# EAGLE design Enclosure 100x68 PBC-AZ (EAGLE 9.6.1)
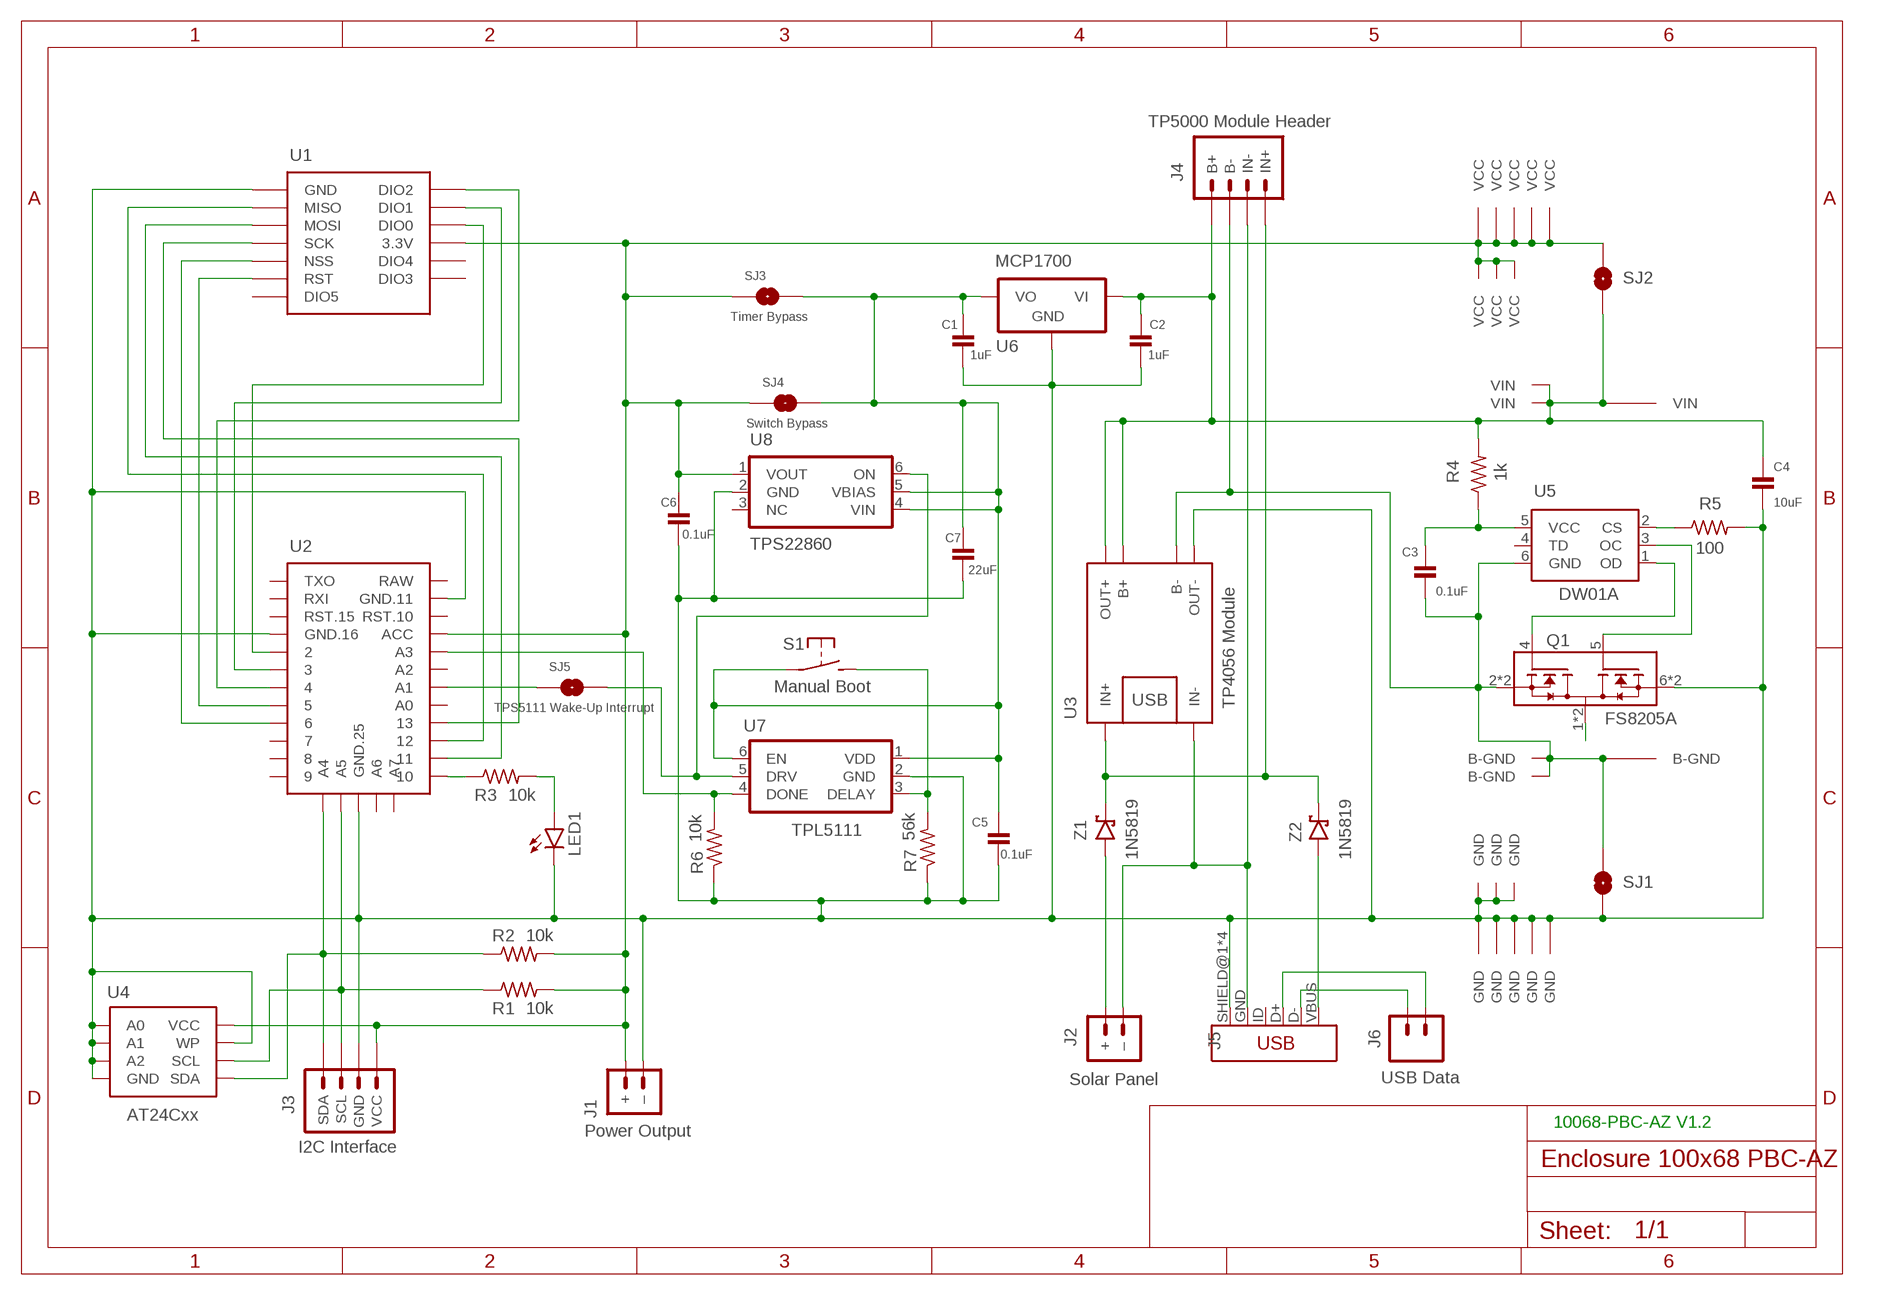
[diagram p0: schematic, sheet 1]
FRAME1 (A4L-LOC): TITLE: 10068-PBC-AZ V1.0

## Parts
C1  1uF  CAPACITOR  [C0805]
C2  1uF  CAPACITOR  [C0805]
C3  0.1uF  CAPACITOR  [C0805]
C4  10uF  CAPACITOR  [C0805]
C5  0.1uF  CAPACITOR  [C0805]
C6  0.1uF  CAPACITOR  [C0805]
C7  22uF  CAPACITOR  [C0805]
J1  Power Output  JST-PH1.25-MALE  [JST-PH1.25]
J2  Solar Panel  JST-PH2.0-MALE  [JST-PH2.0]
J3  I2C Interface  I2C-PIN-HEADER  [CONN_04-GENERIC]
J4  TP5000 Module Header  TP5000-MODULE  [CONN_04-GENERIC]
J5  USB  USB_MINI-B_SMT  [USB-MINIB]
J6  USB Data  1X2-PIN-HEADER  [CONN_02-GENERIC]
LED1  LEDCHIP-LED0805  [CHIP-LED0805]
Q1  FS8205A  [SOP65P640X120-8N]
R1  10k  RESISTORR0805  [R0805]
R2  10k  RESISTORR0805  [R0805]
R3  10k  RESISTORR0805  [R0805]
R4  1k  RESISTORR0805  [R0805]
R5  100  RESISTORR0805  [R0805]
R6  10k  RESISTORR0805  [R0805]
R7  56k  RESISTORR0805  [R0805]
S1  Manual Boot  2-PIN-MOMENTARY-SWITCH  [2-PAD-SWITCH]
SJ3  Timer Bypass  SJ  [SJ]
SJ4  Switch Bypass  SJ  [SJ]
SJ5  TPS5111 Wake-Up Interrupt  SJ  [SJ]
U1  RFM95W  RFM95W-PI  [RFM95W-PI]
U2  Arduino Pro Mini  ARDUINO-PRO-MINI  [PRO-MINI-29]
U3  TP4056 Module  BATTERY-CHARGER-LI-PROT  [BATTERY-CHARGER-LI-PROT]
U4  AT24Cxx  AT24CXX-EEPROM  [SOP-8]
U5  DW01A  [SOT23-6]
U6  MCP1700  [SOT23]
U7  TPL5111  TPL5111DDCR  [SOT-23-6]
U8  TPS22860  [SOT-23-6]
U$5  PROTO-34X22-BAT-SJ-CHG-Z  [PROTO-34X22-BAT-SJ-CHG-Z]
Z1  1N5819  1N5819-SOD-123  [SOD-123]
Z2  1N5819  1N5819-SOD-123  [SOD-123]

## Nets
GND: C1.2 C2.2 C4.2 C5.2 C6.2 C7.2 J1.-(–) J3.2(GND) J5.SHIELD@1(SHIELD) J5.SHIELD@2(SHIELD) J5.SHIELD@3(SHIELD) J5.SHIELD@4(SHIELD) LED1.C Q1.6(S2) Q1.7(S2) R5.2 R6.1 R7.1 U1.GND@3(GND) U1.GND@6(GND) U2.GND@11(GND.25) U2.GND@16(GND.16) U2.GND@25(GND.11) U3.OUT- U4.P$1(A0) U4.P$2(A1) U4.P$3(A2) U4.P$4(GND) U4.P$7(WP) U6.1(GND) U7.2(GND) U8.2(GND) U$5.GND U$5.P33-13(GND) U$5.P33-14(GND) U$5.P33-15(GND) U$5.P34-13(GND) U$5.P34-14(GND) U$5.P34-15(GND) U$5.P34-16(GND) U$5.P34-17(GND)
N$1: J2.+ Z1.A
N$2: J2.-(–) J4.2(IN-) J5.GND U3.IN-
N$3: R5.1 U5.2(CS)
N$4: Q1.1(D12) Q1.8(D12)
N$5: J4.1(IN+) U3.IN+ Z1.C Z2.C
N$6: C2.1 C4.1 J4.4(B+) R4.2 U3.B+ U3.OUT+ U6.3(VI) U$5.P02-17(VIN) U$5.P03-16(VIN) U$5.P06-19(VIN) U$5.VIN
N$7: J3.4(SDA) R2.1 U2.A4 U4.P$5(SDA)
N$8: J3.3(SCL) R1.1 U2.A5 U4.P$6(SCL)
N$9: U1.MISO U2.12
N$10: U1.MOSI U2.11
N$11: U1.SCK U2.13
N$12: R3.1 U2.10
N$13: U1.RST U2.5
N$14: U1.DIO2 U2.4
N$15: U1.DIO1 U2.3
N$16: U1.DIO0 U2.2
N$17: LED1.A R3.2
N$18: Q1.5(G2) U5.3(OC)
N$19: J5.VBUS Z2.A
N$20: Q1.4(G1) U5.1(OD)
N$21: J5.D+ J6.2
N$22: C3.1 R4.1 U5.5(VCC)
N$23: C3.2 J4.3(B-) Q1.2(S1) Q1.3(S1) U3.B- U5.6(GND) U$5.B-GND U$5.P28-19(B-GND) U$5.P32-16(B-GND) U$5.P33-17(B-GND)
N$24: J5.D- J6.1
N$25: R7.2 S1.P$2(S) U7.3(DELAY)
N$26: C1.1 C5.1 C7.1 S1.P$1(P) SJ3.2 SJ4.2 U6.2(VO) U7.1(VDD) U7.6(EN) U8.4(VIN) U8.5(VBIAS)
N$28: SJ5.2 U7.5(DRV) U8.6(ON)
N$29: R6.2 U2.A3 U7.4(DONE)
N$30: SJ5.1 U2.A1
NSS: U1.NSS U2.6
VCC: C6.1 J1.+ J3.1(VCC) R1.2 R2.2 SJ3.1 SJ4.1 U1.3V3(3.3V) U2.ACC U4.P$8(VCC) U8.1(VOUT) U$5.P01-13(VCC) U$5.P01-14(VCC) U$5.P01-15(VCC) U$5.P01-16(VCC) U$5.P01-17(VCC) U$5.P02-13(VCC) U$5.P02-14(VCC) U$5.P02-15(VCC) U$5.VCC
Unconnected: J5.ID U1.DIO3 U1.DIO4 U1.DIO5 U2.7 U2.8 U2.9 U2.A0 U2.A2 U2.A6 U2.A7 U2.RST@10(RST.10) U2.RST@15(RST.15) U2.RXI U2.TXO U5.4(TD) U8.3(NC)

## Notes on the sheet
- SJ2
- SJ1
- 10068-PBC-AZ V1.2

## Power pins joined to a net without a drawn wire
RAW: U2.RAW

## Library data of the parts
C1-C7 = digitalconcepts:CAPACITOR: 0805 Capacitor
J1 = digitalconcepts:JST-PH1.25-MALE: PH1.25 Male PCB Connector
J2 = digitalconcepts:JST-PH2.0-MALE: PH2.0 Male PCB Connector
J3 = digitalconcepts:I2C-PIN-HEADER: I2C Interface Pin Header
J4 = digitalconcepts:TP5000-MODULE: TP5000 Module Pin Header
J5 = digitalconcepts:USB_MINI-B: USB Mini-B Connector Breaks out 5 pins, and includes shield pins if needed.
J6 = digitalconcepts:1X2-PIN-HEADER: Single Row 2-Pin Header
LED1 = digitalconcepts:LED: LED OSRAM: - CHIPLED LG R971, LG N971, LY N971, LG Q971, LY Q971, LO R971, LY R971 LH N974, LH R974 LS Q976, LO Q976, LY Q976 LO Q996 - Hyper CHIPLED LW Q18S LB Q993, LB Q99A, LB R99A - SideLED LS A670, LO A670, LY A670, LG A670, LP A670 LB A673, LV A673, LT A673, LW A673 LH A674 LY A675 LS A676, LA A676, LO A676, LY A676, LW A676 LS A679, LY A679, LG A679 - Hyper Micro SIDELED® LS Y876, LA Y876, LO Y876, LY Y876 LT Y87S - SmartLED LW L88C, LW L88S LB L89C, LB L89S, LG L890 LS L89K, LO L89K, LY L89K LS L896, LA L896, LO L896, LY L896 - TOPLED LS T670, LO T670, LY T670, LG T670, LP T670 LSG T670, LSP T670, LSY T670, LOP T670, LYG T670 LG T671, LOG T671, LSG T671 LB T673, LV T673, LT T673, LW T673 LH T674 LS T676, LA T676, LO T676, LY T676, LB T676, LH T676, LSB T676, LW T676 LB T67C, LV T67C, LT T67C, LS T67K, LO T67K, LY T67K, LW E67C LS E67B, LA E67B, LO E67B, LY E67B, LB E67C, LV E67C, LT E67C LW T67C LS T679, LY T679, LG T679 LS T770, LO T770, LY T770, LG T770, LP T770 LB T773, LV T773, LT T773, LW T773 LH T774 LS E675, LA E675, LY E675, LS T675 LS T776, LA T776, LO T776, LY T776, LB T776 LHGB T686 LT T68C, LB T68C - Hyper Mini TOPLED® LB M676 - Mini TOPLED Santana® LG M470 LS M47K, LO M47K, LY M47K Source: http://www.osram.convergy.de LUXEON: - LUMILED® LXK2-PW12-R00, LXK2-PW12-S00, LXK2-PW14-U00, LXK2-PW14-V00 LXK2-PM12-R00, LXK2-PM12-S00, LXK2-PM14-U00 LXK2-PE12-Q00, LXK2-PE12-R00, LXK2-PE12-S00, LXK2-PE14-T00, LXK2-PE14-U00 LXK2-PB12-K00, LXK2-PB12-L00, LXK2-PB12-M00, LXK2-PB14-N00, LXK2-PB14-P00, LXK2-PB14-Q00 LXK2-PR12-L00, LXK2-PR12-M00, LXK2-PR14-Q00, LXK2-PR14-R00 LXK2-PD12-Q00, LXK2-PD12-R00, LXK2-PD12-S00 LXK2-PH12-R00, LXK2-PH12-S00 LXK2-PL12-P00, LXK2-PL12-Q00, LXK2-PL12-R00 Source: www.luxeon.com KINGBRIGHT: KA-3528ASYC Source: www.kingbright.com
Q1 = FS8205A:FS8205A: N/A; AVAILABILITY: Unavailable; MF: Fortune Semiconductor; MP: FS8205A; PACKAGE: Package; PRICE: None
R1-R7 = digitalconcepts:RESISTOR: RESISTOR, American symbol; SPICEPREFIX: R
S1 = digitalconcepts:2-PIN-MOMENTARY-SWITCH: 2 Pin Momentary Switch
SJ3-SJ5 = digitalconcepts:SJ: Solder Jumper
U1 = digitalconcepts:RFM95W-PI: RFM95W LoRa Wireless Transceiver Raspberry Pi Daughter Board
U2 = digitalconcepts:ARDUINO-PRO-MINI: Arduino Pro Mini 29 [+6] Pin 'Clone'
U3 = digitalconcepts:BATTERY-CHARGER-LI-PROT: TP4056 Li Battery Charger module with PCB (rather than module) footprint
U4 = digitalconcepts:AT24CXX-EEPROM: AT24Cxx EEPROM SOP-8
U5 = DW01A:DW01A; AVAILABILITY: Unavailable; DESCRIPTION: One Cell Lithium-ion/Polymer Battery Protection IC; MF: Fortune Semiconductor; MP: DW01A; PACKAGE: SOT-23-6 Fortune Semiconductor; PRICE: None
U6 = digitalconcepts:MCP1700: MCP1700 Low Quiescent Current LDO Voltage Regulator
U7 = TPL5111DDCR:TPL5111DDCR: TPL5111 Nano-Power System Timer
U8 = TPL5111DDCR:TPS22860: Texas Instruments TPS22860 Ultra-Low Leakage Load Switch
U$5 = digitalconcepts:PROTO-34X22-BAT-SJ-CHG-Z: 34 x 22 Prototyping board, with battery connection (GND + Vcc plane) and space for charging module, voltage regulator, solar panel connection, Arduino Pro Mini and RFM95W daughter board, to fit a 100 x 68 enclosure
Z1 Z2 = digitalconcepts:1N5819-SOD-123: 1N5819 Schottky Diode SOD-123

## Board
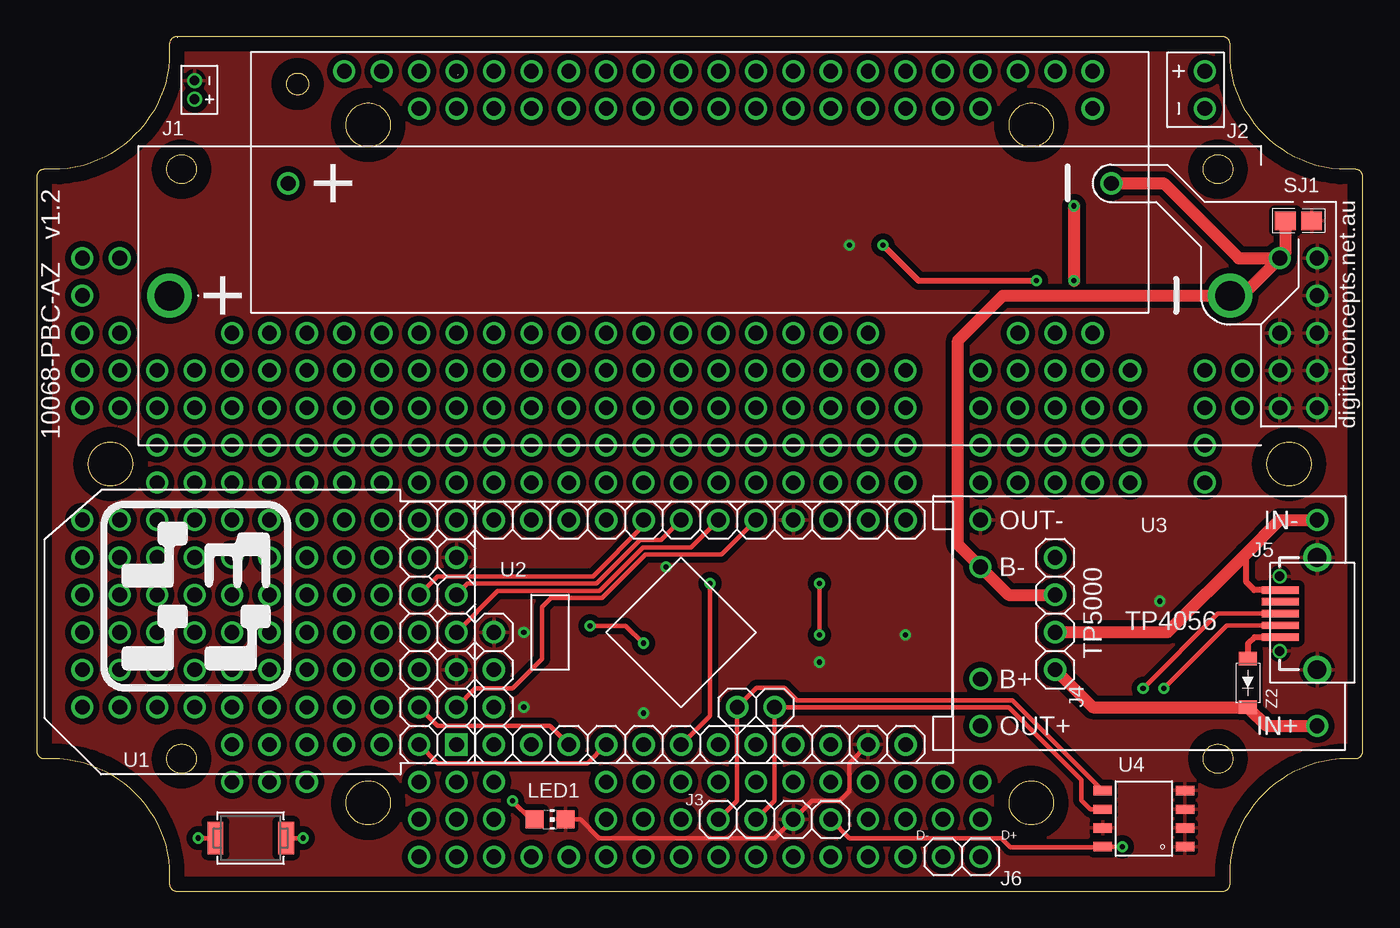
[diagram p1: board, top side]
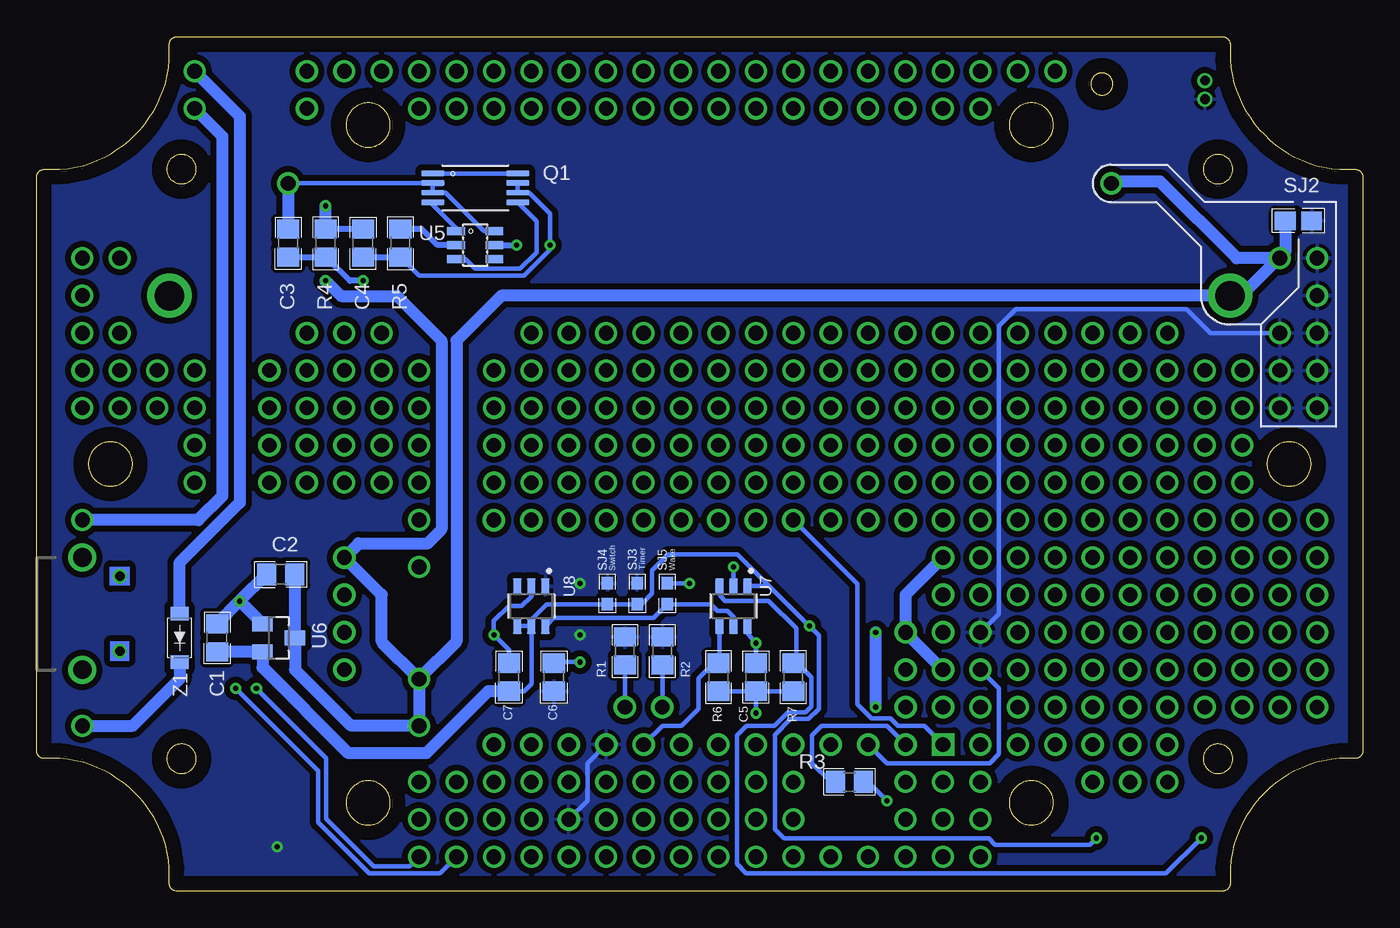
[diagram p2: board, bottom side, seen from below]

Size 90 x 58 mm. Coordinates in mm from the lower left corner, seen from the top.
Outline: 1271 segments
Copper layers (1*16): Top 0.035mm / dielectric 1.5mm / Bottom 0.035mm
Design rules "default *": minimum track width 6mil, minimum drill 0.35mm, track to track 6mil, track to pad 6mil, pad to pad 6mil, via to via 6mil, smd to smd 6mil, copper to edge 40mil, drill to drill 6mil, minimum pad ring 1mil, minimum via ring 8mil, stop-mask expansion 4mil, vias tented up to drill 0mil, thermal gap 10mil

### Footprints (pad centres in the part's own frame; a part is rotated, then mirrored left to right if it is on the bottom)
C0805 = smd 1.3 x 1.5: 1 -0.95,0; 2 0.95,0
JST-PH1.25 = drill 0.65 pad 1.016: + -0.635,0; - 0.635,0
JST-PH2.0 = drill 1: + -1.27,0; - 1.27,0
CONN_04-GENERIC = drill 1 pad 1.524: 1 0,0; 2 2.54,0; 3 5.08,0; 4 7.62,0
USB-MINIB = smd 2.5 x 0.5: D+ 2.5,0; D- 2.5,0.8; GND 2.5,-1.6; ID 2.5,-0.8; VBUS 2.5,1.6 | drill 1.27: SHIELD@1 0,3.81; SHIELD@2 0,-3.81 | drill 0.65 pad 0.762: SHIELD@3 2.54,2.54; SHIELD@4 2.54,-2.54
CONN_02-GENERIC = drill 1 pad 1.524: 1 0,0; 2 2.54,0
CHIP-LED0805 = smd 1.2 x 1.2: A 0,-1.05; C 0,1.05
SOP65P640X120-8N = smd 1.56 x 0.4: 1 -2.88,0.975; 2 -2.88,0.325; 3 -2.88,-0.325; 4 -2.88,-0.975; 5 2.88,-0.975; 6 2.88,-0.325; 7 2.88,0.325; 8 2.88,0.975
R0805 = smd 1.3 x 1.5: 1 -0.95,0; 2 0.95,0
2-PAD-SWITCH = smd 1.067 x 2.184: P$1 -2.4,0; P$2 2.4,0
SJ = smd 0.864 x 0.762: 1 -0.711,0; 2 0.711,0
RFM95W-PI = drill 1 pad 1.524: 3V3 7.62,2.54; DIO0 2.54,0; DIO1 7.62,0; DIO2 10.16,0; DIO3 12.7,2.54; DIO4 15.24,2.54; DIO5 15.24,0; GND@3 5.08,0; GND@6 12.7,0; MISO 2.54,2.54; MOSI 5.08,2.54; RST 10.16,2.54; SCK 0,2.54 | drill 1 pad 1.524 square: NSS 0,0
PRO-MINI-29 = drill 1 pad 1.524: 2 17.78,7.62; 3 15.24,7.62; 4 12.7,7.62; 5 10.16,7.62; 6 7.62,7.62; 7 5.08,7.62; 8 2.54,7.62; 9 0,7.62; 10 0,-7.62; 11 2.54,-7.62; 12 5.08,-7.62; 13 7.62,-7.62; A0 10.16,-7.62; A1 12.7,-7.62; A2 15.24,-7.62; A3 17.78,-7.62; A4 16.51,-5.08; A5 19.05,-5.08; A6 0,-2.54; A7 0,-5.08; ACC 20.32,-7.62; GND@11 25.4,-7.62; GND@16 20.32,7.62; GND@25 0,0; RAW 27.94,-7.62; RST@10 22.86,-7.62; RST@15 22.86,7.62; RXI 25.4,7.62; TXO 27.94,7.62
BATTERY-CHARGER-LI-PROT = drill 1: B+ 10.795,3.81; B- 10.795,-3.81; IN+ -12.065,6.985; IN- -12.065,-6.985; OUT+ 10.795,6.985; OUT- 10.795,-6.985
SOP-8 = smd 0.635 x 1.27: P$1 -1.905,-2.794; P$2 -0.635,-2.794; P$3 0.635,-2.794; P$4 1.905,-2.794; P$5 1.905,2.794; P$6 0.635,2.794; P$7 -0.635,2.794; P$8 -1.905,2.794
SOT23-6 = smd 0.55 x 1.2: 1 -0.95,-1.3; 2 0,-1.3; 3 0.95,-1.3; 4 0.95,1.3; 5 0,1.3; 6 -0.95,1.3
SOT23 = smd 1 x 1.4: 1 -0.95,-1.1; 2 0.95,-1.1; 3 0,1.1
SOT-23-6 = smd 1.1 x 0.6: 1 -1.35,0.95; 2 -1.35,0; 3 -1.35,-0.95; 4 1.35,-0.95; 5 1.35,0; 6 1.35,0.95
PROTO-34X22-BAT-SJ-CHG-Z = smd 1.422 x 1.27: B-GND 39.751,16.51; GND 41.529,16.51 | drill 1: P01-05 -41.91,-16.51; P01-06 -41.91,-13.97; P01-07 -41.91,-11.43; P01-08 -41.91,-8.89; P01-09 -41.91,-6.35; P01-10 -41.91,-3.81; P01-13 -41.91,3.81; P01-14 -41.91,6.35; P01-15 -41.91,8.89; P01-16 -41.91,11.43; P01-17 -41.91,13.97; P02-05 -39.37,-16.51; P02-06 -39.37,-13.97; P02-07 -39.37,-11.43; P02-08 -39.37,-8.89; P02-09 -39.37,-6.35; P02-10 -39.37,-3.81; P02-13 -39.37,3.81; P02-14 -39.37,6.35; P02-15 -39.37,8.89; P02-17 -39.37,13.97; P03-05 -36.83,-16.51; P03-06 -36.83,-13.97; P03-07 -36.83,-11.43; P03-08 -36.83,-8.89; P03-09 -36.83,-6.35; P03-10 -36.83,-3.81; P03-11 -36.83,-1.27; P03-12 -36.83,1.27; P03-13 -36.83,3.81; P03-14 -36.83,6.35; P04-05 -34.29,-16.51; P04-06 -34.29,-13.97; P04-07 -34.29,-11.43; P04-08 -34.29,-8.89; P04-09 -34.29,-6.35; P04-10 -34.29,-3.81; P04-11 -34.29,-1.27; P04-12 -34.29,1.27; P04-13 -34.29,3.81; P04-14 -34.29,6.35; P05-03 -31.75,-21.59; P05-04 -31.75,-19.05; P05-05 -31.75,-16.51; P05-06 -31.75,-13.97; P05-07 -31.75,-11.43; P05-08 -31.75,-8.89; P05-09 -31.75,-6.35; P05-10 -31.75,-3.81; P05-11 -31.75,-1.27; P05-12 -31.75,1.27; P05-13 -31.75,3.81; P05-14 -31.75,6.35; P05-15 -31.75,8.89; P06-03 -29.21,-21.59; P06-04 -29.21,-19.05; P06-05 -29.21,-16.51; P06-06 -29.21,-13.97; P06-07 -29.21,-11.43; P06-08 -29.21,-8.89; P06-09 -29.21,-6.35; P06-10 -29.21,-3.81; P06-11 -29.21,-1.27; P06-12 -29.21,1.27; P06-13 -29.21,3.81; P06-14 -29.21,6.35; P06-15 -29.21,8.89; P06-19 -27.94,19.05; P07-03 -26.67,-21.59; P07-04 -26.67,-19.05; P07-05 -26.67,-16.51; P07-06 -26.67,-13.97; P07-07 -26.67,-11.43; P07-08 -26.67,-8.89; P07-09 -26.67,-6.35; P07-10 -26.67,-3.81; P07-11 -26.67,-1.27; P07-12 -26.67,1.27; P07-13 -26.67,3.81; P07-14 -26.67,6.35; P07-15 -26.67,8.89; P08-04 -24.13,-19.05; P08-05 -24.13,-16.51; P08-06 -24.13,-13.97; P08-07 -24.13,-11.43; P08-08 -24.13,-8.89; P08-09 -24.13,-6.35; P08-10 -24.13,-3.81; P08-11 -24.13,-1.27; P08-12 -24.13,1.27; P08-13 -24.13,3.81; P08-14 -24.13,6.35; P08-15 -24.13,8.89; P08-22 -24.13,26.67; P09-04 -21.59,-19.05; P09-05 -21.59,-16.51; P09-06 -21.59,-13.97; P09-07 -21.59,-11.43; P09-08 -21.59,-8.89; P09-09 -21.59,-6.35; P09-10 -21.59,-3.81; P09-11 -21.59,-1.27; P09-12 -21.59,1.27; P09-13 -21.59,3.81; P09-14 -21.59,6.35; P09-15 -21.59,8.89; P09-22 -21.59,26.67; P10-01 -19.05,-26.67; P10-02 -19.05,-24.13; P10-03 -19.05,-21.59; P10-11 -19.05,-1.27; P10-12 -19.05,1.27; P10-13 -19.05,3.81; P10-14 -19.05,6.35; P10-15 -19.05,8.89; P10-21 -19.05,24.13; P10-22 -19.05,26.67; P11-01 -16.51,-26.67; P11-02 -16.51,-24.13; P11-03 -16.51,-21.59; P11-11 -16.51,-1.27; P11-12 -16.51,1.27; P11-13 -16.51,3.81; P11-14 -16.51,6.35; P11-15 -16.51,8.89; P11-21 -16.51,24.13; P11-22 -16.51,26.67; P12-01 -13.97,-26.67; P12-02 -13.97,-24.13; P12-03 -13.97,-21.59; P12-11 -13.97,-1.27; P12-12 -13.97,1.27; P12-13 -13.97,3.81; P12-14 -13.97,6.35; P12-15 -13.97,8.89; P12-21 -13.97,24.13; P12-22 -13.97,26.67; P13-01 -11.43,-26.67; P13-11 -11.43,-1.27; P13-12 -11.43,1.27; P13-13 -11.43,3.81; P13-14 -11.43,6.35; P13-15 -11.43,8.89; P13-21 -11.43,24.13; P13-22 -11.43,26.67; P14-01 -8.89,-26.67; P14-11 -8.89,-1.27; P14-12 -8.89,1.27; P14-13 -8.89,3.81; P14-14 -8.89,6.35; P14-15 -8.89,8.89; P14-21 -8.89,24.13; P14-22 -8.89,26.67; P15-01 -6.35,-26.67; P15-02 -6.35,-24.13; P15-03 -6.35,-21.59; P15-11 -6.35,-1.27; P15-12 -6.35,1.27; P15-13 -6.35,3.81; P15-14 -6.35,6.35; P15-15 -6.35,8.89; P15-21 -6.35,24.13; P15-22 -6.35,26.67; P16-01 -3.81,-26.67; P16-02 -3.81,-24.13; P16-03 -3.81,-21.59; P16-11 -3.81,-1.27; P16-12 -3.81,1.27; P16-13 -3.81,3.81; P16-14 -3.81,6.35; P16-15 -3.81,8.89; P16-21 -3.81,24.13; P16-22 -3.81,26.67; P17-01 -1.27,-26.67; P17-02 -1.27,-24.13; P17-03 -1.27,-21.59; P17-11 -1.27,-1.27; P17-12 -1.27,1.27; P17-13 -1.27,3.81; P17-14 -1.27,6.35; P17-15 -1.27,8.89; P17-21 -1.27,24.13; P17-22 -1.27,26.67; P18-01 1.27,-26.67; P18-03 1.27,-21.59; P18-11 1.27,-1.27; P18-12 1.27,1.27; P18-13 1.27,3.81; P18-14 1.27,6.35; P18-15 1.27,8.89; P18-21 1.27,24.13; P18-22 1.27,26.67; P19-01 3.81,-26.67; P19-03 3.81,-21.59; P19-11 3.81,-1.27; P19-12 3.81,1.27; P19-13 3.81,3.81; P19-14 3.81,6.35; P19-15 3.81,8.89; P19-21 3.81,24.13; P19-22 3.81,26.67; P20-01 6.35,-26.67; P20-03 6.35,-21.59; P20-11 6.35,-1.27; P20-12 6.35,1.27; P20-13 6.35,3.81; P20-14 6.35,6.35; P20-15 6.35,8.89; P20-21 6.35,24.13; P20-22 6.35,26.67; P21-01 8.89,-26.67; P21-03 8.89,-21.59; P21-11 8.89,-1.27; P21-12 8.89,1.27; P21-13 8.89,3.81; P21-14 8.89,6.35; P21-15 8.89,8.89; P21-21 8.89,24.13; P21-22 8.89,26.67; P22-01 11.43,-26.67; P22-02 11.43,-24.13; P22-03 11.43,-21.59; P22-11 11.43,-1.27; P22-12 11.43,1.27; P22-13 11.43,3.81; P22-14 11.43,6.35; P22-15 11.43,8.89; P22-21 11.43,24.13; P22-22 11.43,26.67; P23-01 13.97,-26.67; P23-02 13.97,-24.13; P23-03 13.97,-21.59; P23-11 13.97,-1.27; P23-12 13.97,1.27; P23-13 13.97,3.81; P23-14 13.97,6.35; P23-21 13.97,24.13; P23-22 13.97,26.67; P24-02 16.51,-24.13; P24-03 16.51,-21.59; P24-21 16.51,24.13; P24-22 16.51,26.67; P25-02 19.05,-24.13; P25-03 19.05,-21.59; P25-11 19.05,-1.27; P25-12 19.05,1.27; P25-13 19.05,3.81; P25-14 19.05,6.35; P25-21 19.05,24.13; P25-22 19.05,26.67; P26-11 21.59,-1.27; P26-12 21.59,1.27; P26-13 21.59,3.81; P26-14 21.59,6.35; P26-15 21.59,8.89; P26-22 21.59,26.67; P27-11 24.13,-1.27; P27-12 24.13,1.27; P27-13 24.13,3.81; P27-14 24.13,6.35; P27-15 24.13,8.89; P27-22 24.13,26.67; P28-11 26.67,-1.27; P28-12 26.67,1.27; P28-13 26.67,3.81; P28-14 26.67,6.35; P28-15 26.67,8.89; P28-19 27.94,19.05; P28-21 26.67,24.13; P28-22 26.67,26.67; P29-11 29.21,-1.27; P29-12 29.21,1.27; P29-13 29.21,3.81; P29-14 29.21,6.35; P31-11 34.29,-1.27; P31-12 34.29,1.27; P31-13 34.29,3.81; P31-14 34.29,6.35; P32-13 36.83,3.81; P32-14 36.83,6.35; P33-13 39.37,3.81; P33-14 39.37,6.35; P33-15 39.37,8.89; P33-17 39.37,13.97; P34-13 41.91,3.81; P34-14 41.91,6.35; P34-15 41.91,8.89; P34-16 41.91,11.43; P34-17 41.91,13.97 | drill 2: P03-16 -36.005,11.43; P32-16 36.005,11.43 | smd 1.422 x 1.27 bottom: VCC -41.529,16.51; VIN -39.751,16.51
SOD-123 = smd 0.91 x 1.22: A -1.65,0; C 1.65,0

### Placement (x,y rotation side)
C1  77.77,17.19 90 bottom
C2  73.45,21.51 180 bottom
C3  72.94,43.99 90 bottom
C4  67.86,43.99 270 bottom
C5  41.19,14.52 270 bottom
C6  54.91,14.52 90 bottom
C7  57.95,14.52 90 bottom
J1  10.71,54.4 90 top
J2  79.29,54.4 270 top
J3  53.89,4.87 180 top
J4  69.13,15.03 90 top
J5  86.91,18.84 180 top
J6  61.51,2.33 0 top
LED1  34.84,4.87 270 top
Q1  60.24,47.74 0 bottom
R1  50.08,16.3 90 bottom
R2  47.54,16.3 90 bottom
R3  34.84,7.41 0 bottom
R4  70.4,43.99 90 bottom
R5  65.32,43.99 270 bottom
R6  43.73,14.52 90 bottom
R7  38.65,14.52 90 bottom
S1  14.52,3.6 180 top
SJ3  49.24,20.19 270 bottom
SJ4  51.27,20.19 270 bottom
SJ5  47.21,20.19 270 bottom
U1  28.49,9.95 90 top
U2  31.03,17.57 0 top
U3  74.84,18.2 180 top
U4  75.15,4.92 90 top
U5  60.24,43.86 270 bottom
U6  73.57,17.19 270 bottom
U7  42.71,19.35 270 bottom
U8  56.43,19.35 270 bottom
U$5  45,29 0 top
Z1  80.31,17.19 270 bottom
Z2  82.21,14.14 270 top

### Tracks (layer width: path | path; a pad name or v marks a point on that pad's centre or on a via)
GND  (via drill 0.35)
  Top 0.305: U2.GND@11 55.16,8.68 55.16,6.77 54.52,6.14 52.62,6.14 J3.2 50.08,3.6 38.18,3.6 36.91,4.87 LED1.C
  Bottom 0.305: R5.2 64.06,41.78 56.93,41.78 55.16,43.55 v55.16,43.86 55.16,45.98 56.59,47.41 Q1.6 Q1.7 | R7.1 C5.2 | C5.2 R6.1 | v42.71,22.01 U7.2 | 56.44,20.66 U8.2 | U8.2 56.43,20.06 | C7.2 57.95,16.38 v58.97,17.39 59,17.35 59,18.35 57.96,19.35 57.09,19.35 56.43,20.01 U8.2 | C6.2 54.83,15.55 v53.13,15.55 | C5.2 v41.19,12.08
  Bottom 0.406: C4.2 R5.2
  Bottom 0.813: C2.2 v76.22,19.68 | v76.22,19.68 U6.1 | C1.2 v76.22,19.68 | U1.GND@3 U2.GND@25 31.03,20.11 U1.GND@6 | v33.06,17.57 v33.06,12.49
  pour Top (isolate 0.406): -1.48,59.48 -1.48,-1.48 91.61,-1.48 91.61,59.48
N$1
  Bottom 0.813: J2.+ 76.23,52.61 76.23,26.37 80.33,22.27 80.33,18.86 Z1.A
N$2
  Top 0.152: 82.64,20.44 82.63,20.45
  Top 0.406: 82.63,20.45 82.08,21 82.08,22.9 | J5.GND 82.64,20.44
  Top 0.813: U3.IN- 84.37,25.19 82.08,22.9 76.75,17.57 J4.2
  Bottom 0.813: U3.IN- 79.04,25.19 77.38,26.84 77.38,51.22 J2.-
N$3
  Bottom 0.406: R5.1 63.86,44.94 62.78,43.86 U5.2
N$4
  Bottom 0.305: Q1.8 Q1.1
N$5
  Top 0.813: U3.IN+ 83.48,11.22 Z2.C 81.75,12.49 81.75,12.48 71.68,12.48 J4.1
  Bottom 0.813: U3.IN+ 83.48,11.22 80.31,14.4 Z1.C
N$6  (via drill 0.35)
  Top 0.813: v70.4,46.53 v70.4,41.45
  Bottom 0.152: 72.5,17.21 U6.3
  Bottom 0.406: C4.1 R4.2
  Bottom 0.813: C2.1 72.5,17.21 | U6.3 72.47,15.03 68.66,11.22 U3.OUT+ U3.B+ | U3.B+ 66.59,16.93 66.59,20.11 J4.4 68.16,23.61 63.47,23.61 62.53,24.55 62.53,37.38 65.55,40.4 69.36,40.4 v70.4,41.45 | U$5.P06-19 16.93,48.18 13.76,48.18 8.55,42.97 U$5.P02-17 | U$5.P02-17 5.69,42.97 8.23,40.43 U$5.P03-16 58.46,40.43 61.51,37.38 61.51,16.93 U3.B+ | U$5.P02-17 5.26,43.34 5.26,45.5 U$5.VIN | R4.2 v70.4,46.53
N$7
  Top 0.305: J3.4 47.54,6.14 U2.A4 48.83,13.78 50.77,13.78 51.6,12.95 66.21,12.95 72.33,6.83 U4.P$5
  Bottom 0.305: R2.1 U2.A4
N$8
  Top 0.305: J3.3 50.08,6.14 U2.A5 65.98,12.49 70.91,7.56 70.91,6.16 71.52,5.56 U4.P$6
  Bottom 0.305: R1.1 U2.A5
N$9
  Top 0.305: U1.MISO 27.22,11.22 34.84,11.22 U2.12
N$10
  Bottom 0.305: U1.MOSI 24.68,13.76 24.68,9.31 25.31,8.68 32.3,8.68 U2.11
N$11
  Top 0.305: U1.SCK 27.22,8.68 37.38,8.68 U2.13
N$12
  Bottom 0.305: U2.10 32.3,11.22 36.74,11.22 37.38,10.58 37.38,8.68 36.11,7.41 R3.1
N$13
  Top 0.305: U1.RST 27.22,21.38 37.76,21.38 41.19,24.81 U2.5
N$14
  Top 0.305: U1.DIO2 29.25,20.87 37.99,20.87 40.96,23.84 42.38,23.84 U2.4
N$15
  Top 0.305: U1.DIO1 31.28,20.36 38.19,20.36 41.16,23.34 44.42,23.34 U2.3
N$16
  Top 0.305: U1.DIO0 29.76,13.76 32.3,13.76 34.31,15.77 34.31,19.3 34.92,19.91 38.38,19.91 41.33,22.85 46.47,22.85 U2.2
N$17  (via drill 0.35)
  Top 0.305: v32.3,6.14 32.3,6.11 33.54,4.87 LED1.A
  Bottom 0.305: v32.3,6.14 33.57,7.41 R3.2
N$18
  Bottom 0.305: Q1.5 56.09,45.5 56.09,43.36 57.2,42.25 60.24,42.25 60.9,42.91 U5.3
N$19
  Top 0.406: J5.VBUS 82.64,17.24 82.21,16.81 Z2.A
N$20
  Bottom 0.305: Q1.4 63.12,46.59 61.54,45.01 U5.1
N$21  (via drill 0.35)
  Top 0.305: J5.D+ 80.18,18.84 v75.1,13.76
  Bottom 0.305: v75.1,13.76 70.35,9.01 70.35,4.89 67.15,1.69 64.68,1.69 J6.2
N$22  (via drill 0.35)
  Top 0.406: v57.45,43.86 59.86,41.45 v67.86,41.45
  Bottom 0.406: C3.1 R4.1 70.38,43.02 70.32,43.02 68.75,41.45 v67.86,41.45 | U5.5 v57.45,43.86
N$23
  Top 0.813: U$5.P33-17 81.83,40.43 U$5.P32-16 65.57,40.43 62.53,37.38 62.53,23.54 U3.B- 65.95,20.11 J4.3 | U$5.P28-19 76.5,48.05 81.58,42.97 U$5.P33-17 | U$5.B-GND 84.75,43.35 U$5.P33-17
  Bottom 0.305: Q1.2 Q1.3 62.25,47.41 59.65,44.81 U5.6 | 62.49,48.05 U$5.P28-19
  Bottom 0.406: Q1.2 62.49,48.05
  Bottom 0.813: U$5.P28-19 C3.2
N$24  (via drill 0.35)
  Top 0.305: J5.D- 80.78,18.04 v76.5,13.76
  Bottom 0.305: v76.5,13.76 70.91,8.17 70.91,4.68 67.44,1.21 62.62,1.21 J6.1
N$25  (via drill 0.35)
  Top 0.305: v10.96,3.6 S1.P$2
  Bottom 0.152: R7.2 38.45,15.67
  Bottom 0.305: v10.96,3.6 13.35,1.21 41.85,1.21 42.48,1.85 42.48,10.56 41.82,11.22 39.93,11.22 39.02,12.13 37.81,12.13 37.4,12.54 37.4,14.51 38.37,15.47 R7.2 | U7.3 43.63,20.06 43.27,19.7 40.33,19.7 38.45,17.82 38.45,15.67
N$26  (via drill 0.35)
  Top 0.305: v37.56,18 39.94,18 v41.19,16.83 | v18.08,3.6 S1.P$1
  Bottom 0.203: SJ3.2 48.96,19.46
  Bottom 0.305: v18.08,3.6 v18.09,3.6 18.53,3.16 24.95,3.16 25.38,3.59 39.28,3.59 39.89,4.21 39.89,10.61 38.83,11.68 37.61,11.68 36.92,12.36 36.92,17.37 v37.56,18 37.58,18 40.29,20.71 | C5.1 v41.19,16.83 41.74,17.46 U7.6 | C7.1 56.91,13.57 56.43,14.05 U8.5 | SJ3.2 SJ4.2 55.4,19.46 56.43,18.43 U8.5 | 40.29,20.71 42.43,22.85 47.14,22.85 48.23,21.77 48.23,20.2 48.96,19.46 | U8.5 U8.4 | U7.1 40.29,20.71
  Bottom 0.813: C1.1 U6.2 74.67,15.18 68.86,9.37 63.57,9.37 59.36,13.57 C7.1
N$28
  Bottom 0.203: U7.5 42.68,18.2
  Bottom 0.305: U8.6 55.41,18.05 54.91,18.55 48.15,18.55 47.23,19.46 SJ5.2 44.24,19.46 43.8,19.02 43.11,19.02 42.68,18.59 42.68,18.2
N$29
  Bottom 0.305: U7.4 43.66,15.47 R6.2 44.05,15.47 45.08,14.45 45.08,12.39 46.24,11.22 47.54,11.22 U2.A3
N$30  (via drill 0.35)
  Top 0.305: v45.69,20.9 45.69,11.89 43.75,9.95 U2.A1
  Bottom 0.305: v45.69,20.9 SJ5.1
NSS
  Bottom 0.305: U1.NSS 29.76,11.22 31.54,11.22 32.05,11.73 33.34,11.73 34.31,12.69 34.31,20.85 U2.6
VCC  (via drill 0.35)
  Top 0.305: J3.1 55.16,3.6 65.47,3.6 66.08,2.99 72.33,2.99 U4.P$8 v73.68,3.02 | v53.13,20.9 v53.13,17.39
  Bottom 0.305: J3.1 52.62,6.14 52.62,8.68 U2.ACC | U1.3V3 24.69,18.83 24.69,38.35 23.53,39.52 11.95,39.52 10.33,37.89 U$5.P02-15
  pour Bottom (isolate 0.406): -0.21,58.21 -0.21,-0.21 90.34,-0.21 90.34,58.21

### Text on the board
tPlace: J1 | J2 | + | SJ1 | + | 10068-PBC-AZ v1.2 | digitalconcepts.net.au | TP4056 | TP5000 | D- | D+
bPlace: SJ2 | Wake | Timer | Switch